# EAGLE design tree_lamp_2 (EAGLE 5.11)
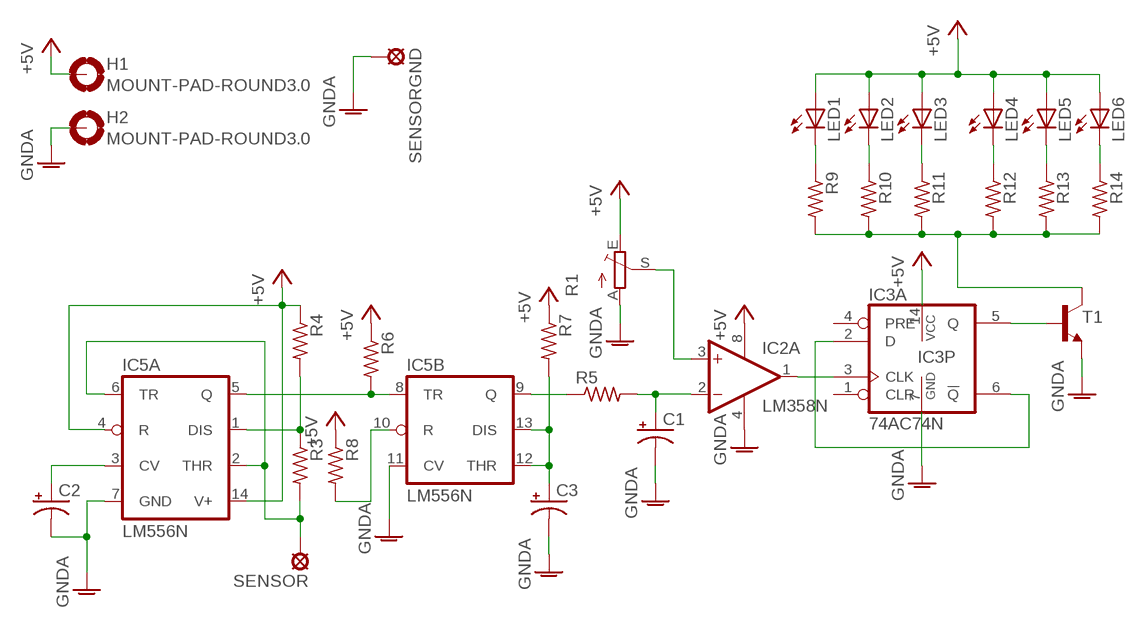
[diagram p0: schematic, sheet 1]

## Parts
C1  CPOL-USB45181B  [B45181B]
C2  CPOL-USB45181A  [B45181A]
C3  CPOL-USB45181B  [B45181B]
H1  MOUNT-PAD-ROUND3.0  [3,0-PAD]
H2  MOUNT-PAD-ROUND3.0  [3,0-PAD]
IC2  LM358N  [DIL08]
IC3  74AC74N  [DIL14]
IC5  LM556N  [DIL14]
LED1  LED5MM  [LED5MM]
LED2  LED5MM  [LED5MM]
LED3  LED5MM  [LED5MM]
LED4  LED5MM  [LED5MM]
LED5  LED5MM  [LED5MM]
LED6  LED5MM  [LED5MM]
R1  TRIM_EU-B25V  [B25V]
R3  R-US_0204/5  [0204/5]
R4  R-US_0204/5  [0204/5]
R5  R-US_0204/5  [0204/5]
R6  R-US_0204/5  [0204/5]
R7  R-US_0204/5  [0204/5]
R8  R-US_0204/5  [0204/5]
R9  R-US_0204/5  [0204/5]
R10  R-US_0204/5  [0204/5]
R11  R-US_0204/5  [0204/5]
R12  R-US_0204/5  [0204/5]
R13  R-US_0204/5  [0204/5]
R14  R-US_0204/5  [0204/5]
SENSOR  LSP11  [LSP11]
SENSORGND  LSP11  [LSP11]
T1  -NPN-TO92  [TO92]

## Nets
+5V: H1.B3,0(MOUNT) IC2.8(P:V+) IC3.14(P:VCC) IC5.4(A:R) IC5.14(A:V+) LED1.A LED2.A LED3.A LED4.A LED5.A LED6.A R1.E R4.1 R6.1 R7.1 R8.1
GNDA: C1.- C2.- C3.- H2.B3,0(MOUNT) IC2.4(P:V-) IC3.7(P:GND) IC5.7(A:GND) IC5.11(B:CV) R1.A SENSORGND.MP T1.1(E)
N$2: IC3.5(A:Q) T1.2(B)
N$3: IC2.3(A:+IN) R1.S
N$4: IC5.5(A:Q) IC5.8(B:TR) R6.2
N$5: IC3.2(A:D) IC3.6(A:!Q)
N$6: IC2.1(A:OUT) IC3.3(A:CLK)
N$7: IC5.9(B:Q) R5.1
N$8: C2.+ IC5.3(A:CV)
N$9: C1.+ IC2.2(A:-IN) R5.2
N$10: LED2.K(C) R10.1
N$11: IC5.1(A:DIS) R3.1 R4.2
N$12: LED6.K(C) R14.1
N$13: C3.+ IC5.12(B:THR) IC5.13(B:DIS) R7.2
N$14: IC5.10(B:R) R8.2
N$15: LED4.K(C) R12.1
N$16: LED5.K(C) R13.1
N$17: LED3.K(C) R11.1
N$18: LED1.K(C) R9.1
N$19: R9.2 R10.2 R11.2 R12.2 R13.2 R14.2 T1.3(C)
N$SENSOR: IC5.2(A:THR) IC5.6(A:TR) R3.2 SENSOR.MP
Unconnected: IC2.5(B:+IN) IC2.6(B:-IN) IC2.7(B:OUT) IC3.1(A:CLR) IC3.4(A:PRE) IC3.8(B:!Q) IC3.9(B:Q) IC3.10(B:PRE) IC3.11(B:CLK) IC3.12(B:D) IC3.13(B:CLR)

## Library data of the parts
C1-C3 = rcl:CPOL-US: POLARIZED CAPACITOR, American symbol
H1 H2 = holes:MOUNT-PAD-ROUND: MOUNTING PAD, round
IC2 = linear:LM358: OP AMP also LM158; LM258; LM2904 Source: http://cache.national.com/ds/LM/LM158.pdf
IC3 = 74xx-eu:74*74: Dual D type positive edge triggered FLIP FLOP, preset and clear
IC5 = linear:*556: Dual TIMER
LED1-LED6 = led:LED: LED OSRAM: - CHIPLED LG R971, LG N971, LY N971, LG Q971, LY Q971, LO R971, LY R971 LH N974, LH R974 LS Q976, LO Q976, LY Q976 LO Q996 - Hyper CHIPLED LW Q18S LB Q993, LB Q99A, LB R99A - SideLED LS A670, LO A670, LY A670, LG A670, LP A670 LB A673, LV A673, LT A673, LW A673 LH A674 LY A675 LS A676, LA A676, LO A676, LY A676, LW A676 LS A679, LY A679, LG A679 - Hyper Micro SIDELED® LS Y876, LA Y876, LO Y876, LY Y876 LT Y87S - SmartLED LW L88C, LW L88S LB L89C, LB L89S, LG L890 LS L89K, LO L89K, LY L89K LS L896, LA L896, LO L896, LY L896 - TOPLED LS T670, LO T670, LY T670, LG T670, LP T670 LSG T670, LSP T670, LSY T670, LOP T670, LYG T670 LG T671, LOG T671, LSG T671 LB T673, LV T673, LT T673, LW T673 LH T674 LS T676, LA T676, LO T676, LY T676, LB T676, LH T676, LSB T676, LW T676 LB T67C, LV T67C, LT T67C, LS T67K, LO T67K, LY T67K, LW E67C LS E67B, LA E67B, LO E67B, LY E67B, LB E67C, LV E67C, LT E67C LW T67C LS T679, LY T679, LG T679 LS T770, LO T770, LY T770, LG T770, LP T770 LB T773, LV T773, LT T773, LW T773 LH T774 LS E675, LA E675, LY E675, LS T675 LS T776, LA T776, LO T776, LY T776, LB T776 LHGB T686 LT T68C, LB T68C - Hyper Mini TOPLED® LB M676 - Mini TOPLED Santana® LG M470 LS M47K, LO M47K, LY M47K Source: http://www.osram.convergy.de LUXEON: - LUMILED® LXK2-PW12-R00, LXK2-PW12-S00, LXK2-PW14-U00, LXK2-PW14-V00 LXK2-PM12-R00, LXK2-PM12-S00, LXK2-PM14-U00 LXK2-PE12-Q00, LXK2-PE12-R00, LXK2-PE12-S00, LXK2-PE14-T00, LXK2-PE14-U00 LXK2-PB12-K00, LXK2-PB12-L00, LXK2-PB12-M00, LXK2-PB14-N00, LXK2-PB14-P00, LXK2-PB14-Q00 LXK2-PR12-L00, LXK2-PR12-M00, LXK2-PR14-Q00, LXK2-PR14-R00 LXK2-PD12-Q00, LXK2-PD12-R00, LXK2-PD12-S00 LXK2-PH12-R00, LXK2-PH12-S00 LXK2-PL12-P00, LXK2-PL12-Q00, LXK2-PL12-R00 Source: www.luxeon.com KINGBRIGHT: KA-3528ASYC Source: www.kingbright.com
R1 = pot:TRIM_EU-: POTENTIOMETER
R3-R14 = rcl:R-US_: RESISTOR, American symbol
SENSOR SENSORGND = solpad:LSP11: SOLDER PAD drill 1.1 mm
T1 = transistor:*-NPN-: NPN Transistror BF959 corrected 2008.03.06

## Board
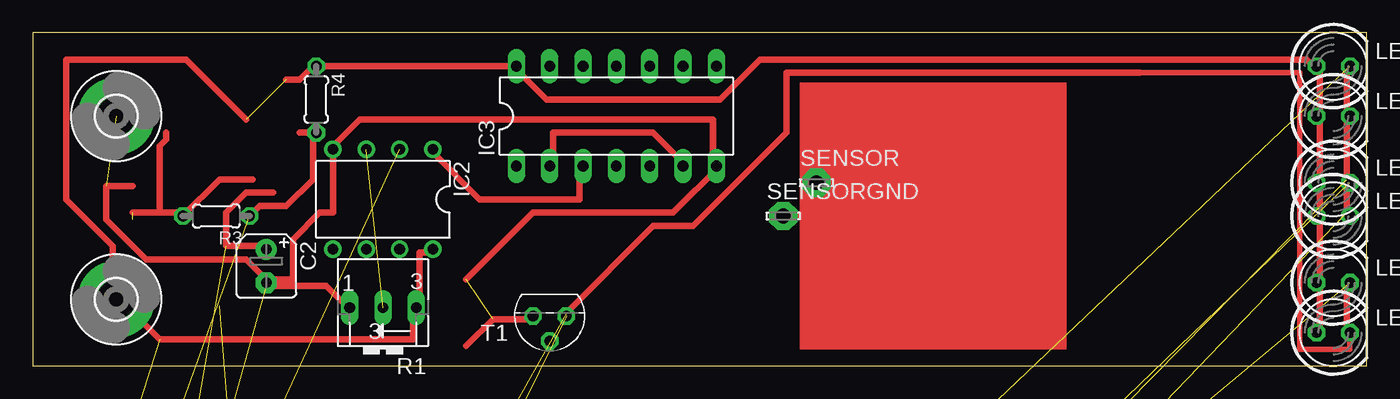
[diagram p1: board, top side]
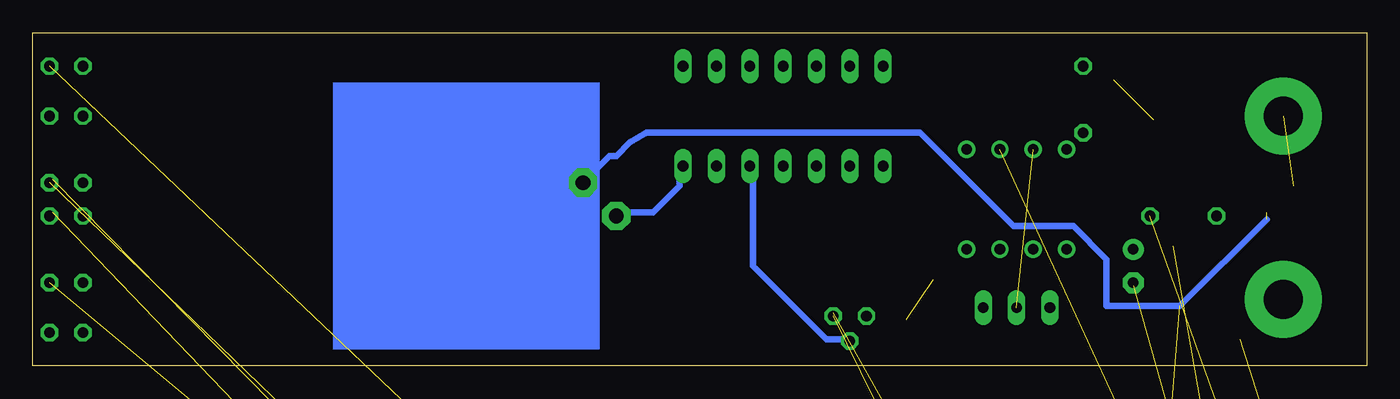
[diagram p2: board, bottom side, seen from below]

Size 101.6 x 25.4 mm. Coordinates in mm from the lower left corner, seen from the top.
Outline: 0,0 101.6,0 101.6,25.4 0,25.4 0,0
Copper layers (1*16): Top 0.035mm / dielectric 1.5mm / Bottom 0.035mm
Design rules "default *": minimum track width 20mil, minimum drill 24mil, track to track 20mil, track to pad 20mil, pad to pad 20mil, via to via 20mil, smd to smd 8mil, copper to edge 40mil, drill to drill 40mil, minimum pad ring 10mil, minimum via ring 8mil, stop-mask expansion 4mil, vias tented up to drill 0mil, thermal gap 10mil

### Footprints (pad centres in the part's own frame; a part is rotated, then mirrored left to right if it is on the bottom)
B45181B = drill 0.813 round: + -2.54,0 | drill 0.813 octagon: - 2.54,0
B45181A = drill 0.813 pad 1.6 round: + -1.27,0 | drill 0.813 pad 1.6 octagon: - 1.27,0
3,0-PAD = drill 3 pad 5.842 round: B3,0 0,0
DIL08 = drill 0.813 pad 1.27 round: 1 -3.81,-3.81; 2 -1.27,-3.81; 3 1.27,-3.81; 4 3.81,-3.81; 5 3.81,3.81; 6 1.27,3.81; 7 -1.27,3.81; 8 -3.81,3.81
DIL14 = drill 0.813 long: 1 -7.62,-3.81; 2 -5.08,-3.81; 3 -2.54,-3.81; 4 0,-3.81; 5 2.54,-3.81; 6 5.08,-3.81; 7 7.62,-3.81; 8 7.62,3.81; 9 5.08,3.81; 10 2.54,3.81; 11 0,3.81; 12 -2.54,3.81; 13 -5.08,3.81; 14 -7.62,3.81
LED5MM = drill 0.813 octagon: A -1.27,0; K 1.27,0
B25V = drill 0.813 long: A 2.54,0.635; E -2.54,0.635; S 0,0.635
0204/5 = drill 0.813 octagon: 1 -2.54,0; 2 2.54,0
LSP11 = drill 1.118 pad 2.159 octagon: MP 0,0
TO92 = drill 0.813 octagon: 1 1.27,0; 2 0,1.905; 3 -1.27,0

### Placement (x,y rotation side)
C1  3.81,-36.83 0 top  (outside the outline)
C2  17.78,7.62 270 top
C3  3.81,-54.61 0 top  (outside the outline)
H1  6.35,5.08 0 top
H2  6.35,19.05 0 top
IC2  26.67,12.7 180 top
IC3  44.45,19.05 0 top
IC5  11.43,-20.32 0 top  (outside the outline)
LED1  99.06,2.54 0 top
LED2  99.06,22.86 0 top
LED3  99.06,6.35 0 top
LED4  99.06,13.97 0 top
LED5  99.06,19.05 0 top
LED6  99.06,11.43 0 top
R1  26.67,5.08 180 top
R3  13.97,11.43 180 top
R4  21.59,20.32 270 top
R5  3.81,-30.48 0 top  (outside the outline)
R6  3.81,-43.18 0 top  (outside the outline)
R7  3.81,-48.26 0 top  (outside the outline)
R8  3.81,-60.96 0 top  (outside the outline)
R9  3.81,-66.04 0 top  (outside the outline)
R10  3.81,-71.12 0 top  (outside the outline)
R11  3.81,-76.2 0 top  (outside the outline)
R12  3.81,-81.28 0 top  (outside the outline)
R13  3.81,-86.36 0 top  (outside the outline)
R14  3.81,-91.44 0 top  (outside the outline)
SENSOR  59.69,13.97 0 top
SENSORGND  57.15,11.43 0 top
T1  39.37,3.81 180 top

### Tracks (layer width: path | path; a pad name or v marks a point on that pad's centre or on a via)
+5V  (6 unrouted)
  Top 0.508: LED1.A 98.04,2.54 98.04,6.1 LED3.A 98.04,6.6 98.04,11.18 LED6.A 98.04,11.68 98.04,13.72 LED4.A 98.04,14.22 98.04,18.8 LED5.A 98.04,19.3 98.04,22.86 LED2.A 97.54,22.86 97.03,23.37 55.37,23.37 52.32,20.32 39.12,20.32 36.58,22.86 | IC2.8 30.48,8.64 29.46,8.64 29.46,4.57 R1.E 28.96,4.06 28.96,2.03 9.65,2.03 6.6,5.08 H1.B3,0 6.1,5.08 6.1,9.14 2.54,12.7 2.54,23.37 11.68,23.37 16.26,18.8 | 19.3,21.84 20.32,21.84 21.34,22.86 R4.1 36.58,22.86 | 36.58,22.86 IC3.14
GNDA  (6 unrouted)
  Top 0.406: SENSORGND.MP 59.69,11.43
  Top 0.508: 33.02,6.6 38.1,11.68 48.77,11.68 52.32,15.24 IC3.7 51.82,15.24 51.82,18.8 24.89,18.8 22.86,16.76 IC2.4 22.86,11.68 21.84,11.68 19.81,9.65 19.81,6.6 17.78,6.6 | R1.A 23.88,4.57 22.35,6.1 17.78,6.1 C2.- 17.78,6.6 | 7.62,19.3 6.6,19.3 H2.B3,0 7.62,19.3 | 7.62,19.3 9.14,19.3 | 17.78,6.6 16.26,8.13 8.64,8.13 5.59,11.18 5.59,13.72 7.62,13.72 | 33.02,1.52 35.05,3.56 38.1,3.56 T1.1
  Bottom 0.508: SENSORGND.MP 56.9,11.68 54.36,11.68 52.32,13.72 52.32,15.24 IC3.7
N$2
  Bottom 0.508: T1.2 39.62,2.03 41.15,2.03 46.74,7.62 46.74,15.24 IC3.5
N$3  (1 unrouted)
N$4  (2 unrouted)
N$5
  Top 0.508: IC3.2 39.62,15.24 39.62,17.78 47.24,17.78 49.78,15.24 IC3.6
N$6
  Top 0.508: IC3.3 41.66,15.24 41.66,12.7 34.04,12.7 30.48,16.26 IC2.1
N$7  (1 unrouted)
N$8  (1 unrouted)
  Top 0.508: 18.29,13.21 16.26,13.21 14.73,11.68 14.73,9.14 17.78,9.14 C2.+
N$9  (2 unrouted)
N$10  (1 unrouted)
N$11  (1 unrouted)
  Top 0.508: 21.34,17.78 21.34,14.22 19.3,12.19 17.27,12.19 R3.1 | 21.34,17.78 20.32,17.78 | 21.34,17.78 R4.2
N$12  (1 unrouted)
  Top 0.508: 100.08,13.72 100.08,11.68 LED6.K
N$13  (3 unrouted)
N$14  (1 unrouted)
N$15  (1 unrouted)
N$16  (1 unrouted)
  Top 0.508: 100.08,22.86 100.08,19.3 LED5.K 100.08,18.8 100.08,14.22
N$17  (1 unrouted)
N$18  (1 unrouted)
  Top 0.406: 84.33,22.35 96.52,22.35 96.52,1.27 100.33,1.27 LED1.K
  Top 0.508: 40.64,4.06 47.24,10.67 50.29,10.67 57.4,17.78 57.4,22.35 84.33,22.35 | 100.08,6.1 100.08,2.54 LED1.K
N$19  (6 unrouted)
N$SENSOR  (3 unrouted)
  Top 0.508: 9.65,11.68 7.62,11.68 | 9.65,11.68 11.18,11.68 R3.2 14.22,14.22 16.76,14.22 | 10.16,17.78 10.16,17.27 9.65,16.76 9.65,11.68
  Bottom 0.508: 7.62,11.18 14.22,4.57 19.81,4.57 19.81,8.13 22.35,10.67 26.92,10.67 34.04,17.78 54.86,17.78 56.13,17.02 57.15,16 57.66,16 SENSOR.MP
(copper drawn outside any net)
  shapes: Bottom area x1, Top area x1